# Altium project framework_can_interface.PrjPcb
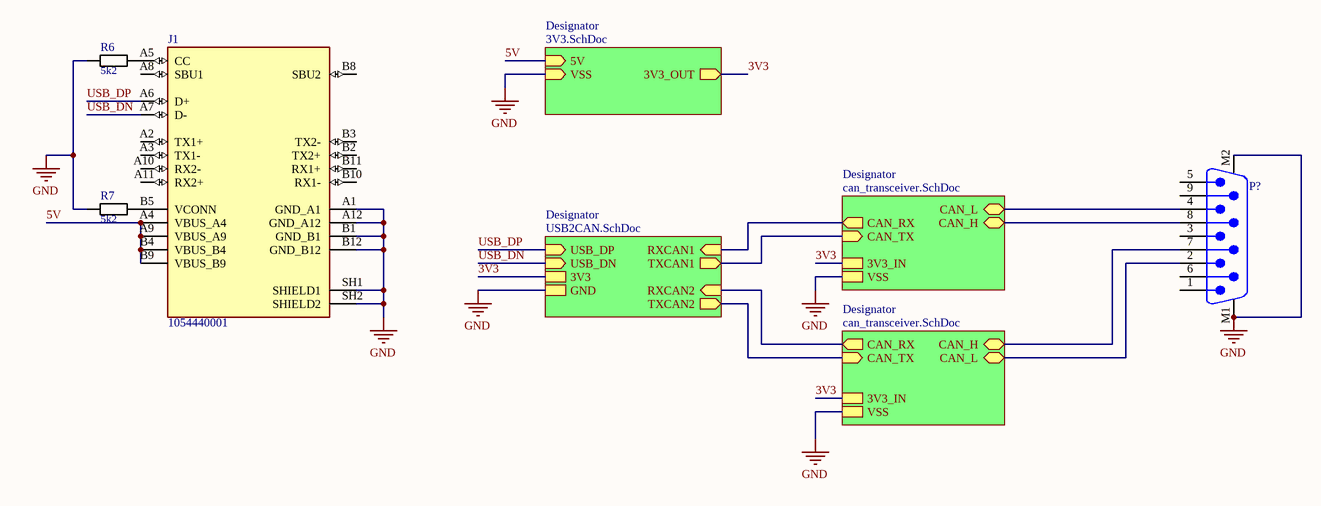
[diagram p0: main.SchDoc]
4 sheets, 52 parts. Net scope: hierarchical (ports join the sheet entries above them; power ports are global).
Board file: main.PcbDoc
Sheets:
  main.SchDoc
    Designator = 3V3.SchDoc
    Designator = USB2CAN.SchDoc
    Designator = can_transceiver.SchDoc
    Designator = can_transceiver.SchDoc

## Sheet main.SchDoc
size A4; SheetNumber: 1; SheetTotal: 4

### Parts
J1  1054440001  [MOLEX_1054440001]
P?  618009211721  [618009211721]  (value not drawn)
R6  5k2  [0603_R]
R7  5k2  [0603_R]

### Sub-sheets
Designator = 3V3.SchDoc: VSS (in), 5V (in), 3V3_OUT (out)
Designator = USB2CAN.SchDoc: USB_DP (in), USB_DN (in), 3V3, GND, RXCAN1 (in), TXCAN1 (out), RXCAN2 (in), TXCAN2 (out)
Designator = can_transceiver.SchDoc: CAN_H (bidir), CAN_L (bidir), CAN_TX (in), CAN_RX (out), 3V3_IN, VSS
Designator = can_transceiver.SchDoc: CAN_H (bidir), CAN_L (bidir), CAN_TX (in), CAN_RX (out), 3V3_IN, VSS

### Nets
3V3: sheet Designator/3V3_OUT, sheet Designator/3V3, sheet Designator/3V3_IN, sheet Designator/3V3_IN
GND: J1.A1(GND_A1) J1.A12(GND_A12) J1.B1(GND_B1) J1.B12(GND_B12) J1.SH1(SHIELD1) J1.SH2(SHIELD2) P?.M1 P?.M2 R6.1 R7.1 ; sheet Designator/VSS, sheet Designator/GND, sheet Designator/VSS, sheet Designator/VSS
5V: J1.A4(VBUS_A4) J1.A9(VBUS_A9) J1.B4(VBUS_B4) J1.B9(VBUS_B9) ; sheet Designator/5V
CAN High: P?.8 ; sheet Designator/CAN_H
CAN High: P?.7 ; sheet Designator/CAN_H  [a separate net that carries the same name]
CAN Low: P?.4 ; sheet Designator/CAN_L
CAN Low: P?.2 ; sheet Designator/CAN_L  [a separate net that carries the same name]
CAN_RX: sheet Designator/RXCAN2, sheet Designator/CAN_RX
CAN_RX: sheet Designator/RXCAN1, sheet Designator/CAN_RX  [a separate net that carries the same name]
CAN_TX: sheet Designator/TXCAN2, sheet Designator/CAN_TX
CAN_TX: sheet Designator/TXCAN1, sheet Designator/CAN_TX  [a separate net that carries the same name]
USB_DN: J1.A7(D-) ; sheet Designator/USB_DN
USB_DP: J1.A6(D+) ; sheet Designator/USB_DP
NetJ1_A5: J1.A5(CC) R6.2
NetJ1_B5: J1.B5(VCONN) R7.2

Not connected (* = marked no-connect by the designer): J1 A2(TX1+) A3(TX1-) A8(SBU1) A10(RX2-) A11(RX2+) B2(TX2+) B3(TX2-) B8(SBU2) B10(RX1-) B11(RX1+); P? 1 3 5 6 9

### Library data of the parts
J1 = 1054440001: USB-C (USB TYPE-C) USB 3.2 Gen 2 (USB 3.1 Gen 2, Superspeed + (USB 3.1)) Plug Connector 24 Position Board Edge, Straddle Mount; MF: Molex; SnapEDA_Link: https://www.snapeda.com/parts/1054440001/Molex/view-part/?ref=snap; Package: None; Value: *; MP: 1054440001; Check_prices: https://www.snapeda.com/parts/1054440001/Molex/view-part/?ref=eda
P? = 618009211721: WR-DSUB 8.08mm Male PCB Connector without Hex Screw, Angled, 9p; Manufacturer: Wurth Elektronik; Contact Resistance: 30mOhm; Rated Current: 3A; Working Voltage: 125VAC; Withstanding Voltage: 1000VAC; Manufacturer Part Number: 618009211721; Category: Input/Output Connectors; Match Code: WR-DSUB; ComponentLink1Description: Website Link; ComponentLink1URL: https://www.we-online.com/redexpert/article/618009211721?ad; ComponentLink2Description: Datasheet Link; ComponentLink2URL: https://www.we-online.com/redexpert/spec/618009211721?ad; Mount: Through Hole; Operating Temperature Max: 105°C; Operating Temperature Min: -55°C; Packaging: Tray; Gender: Male; Number of Pins: 9; Orientation: Angled
R6 R7 = R_0603: R 0603, 75V, 0.1W; EBS_Nummer: %%%; HelpURL: %%%; Value: 5k2

## Sheet 3V3.SchDoc
size A4; SheetNumber: 2; SheetTotal: 4
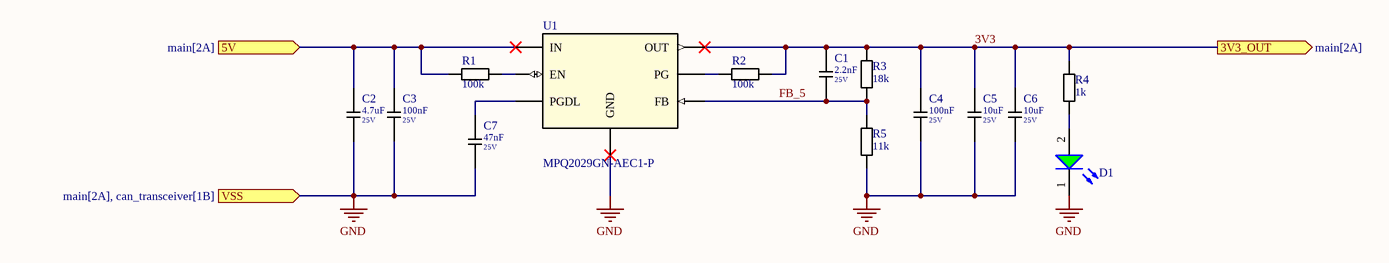
[diagram p1: 3V3.SchDoc]

### Parts
C1  value 2.2nF  Spg: 25V  [0603_C]  (hidden comment: 2.2nF_25V)
C2  value 4.7uF  Spg: 25V  [0603_C]  (hidden comment: 4.7uF_25V)
C3  value 100nF  Spg: 25V  [0603_C]  (hidden comment: 100nF_25V)
C4  value 100nF  Spg: 25V  [0603_C]  (hidden comment: 100nF_25V)
C5  value 10uF  Spg: 25V  [0603_C]  (hidden comment: 10uF_25V)
C6  value 10uF  Spg: 25V  [0603_C]  (hidden comment: 10uF_25V)
C7  value 47nF  Spg: 25V  [0603_C]  (hidden comment: 47nF_25V)
D1  Green, 3.2V, 140°  [WL-SMCD_0603]  (value not drawn)
R1  100k  [0603_R]
R2  100k  [0603_R]
R3  18k  [0603_R]
R4  1k  [0603_R]
R5  11k  [0603_R]
U1  MPQ2029GN-AEC1-P  [SOIC8-EP_MPQ2029_MNP]

### Ports
3V3_OUT (out, see main[2A]), 5V (in, see main[2A]), VSS (in, see main[2A], can_transceiver[1B])

### Nets
3V3: C1.1 C4.1 C5.1 C6.1 R2.2 R3.2 R4.2 U1.1(OUT) ; port 3V3_OUT
GND: C2.2 C3.2 C4.2 C5.2 C6.2 C7.2 D1.1(K) R5.1 U1.3(GND) ; port VSS
5V: C2.1 C3.1 R1.1 U1.4(IN) ; port 5V
FB_5: C1.2 R3.1 R5.2 U1.8(FB)
NetC7_1: C7.1 U1.7(PGDL)
NetD1_2: D1.2(A) R4.1
NetR1_2: R1.2 U1.5(EN)
NetR2_1: R2.1 U1.6(PG)

### Library data of the parts
C1-C7 = C_0603_Keramik: Keramikkondensatoren 0603; EBS_Nummer: %%%; HelpURL: %%%
D1 = 150060GS55040: WL-SMCD Mono-color Chip LED Diffused, SMT, size 0603, Green, 3.2V, 140°; Manufacturer: Wurth Elektronik; Case/Size Code: 0603; Chip Technology: InGaN; Dominant Wavelength: 525nm; Luminous Intensity: 430mcd; Peak Wavelength: 520nm; Manufacturer Part Number: 150060GS55040; Category: Signal LEDs; Match Code: WL-SMCD; ComponentLink1Description: Website Link; ComponentLink1URL: https://www.we-online.com/redexpert/article/150060GS55040?ad; ComponentLink2Description: Datasheet Link; ComponentLink2URL: https://www.we-online.com/redexpert/spec/150060GS55040?ad; Mount: Surface Mount; Operating Temperature Max: 85°C; Operating Temperature Min: -40°C; Packaging: Tape and Reel; Length: 1.6mm; Width: 0.8mm; Height: 0.4mm; Emitting Color: Green; Forward Voltage: 3.2V; Viewing Angle: 140°
R1-R5 = R_0603: R 0603, 75V, 0.1W; EBS_Nummer: %%%; HelpURL: %%%
  R1 R2: Value: 100k
  R3: Value: 18k
  R4: Value: 1k
  R5: Value: 11k
U1 = MPQ2029GN-AEC1-P: No Description Available; pin to pad: 3>3+9; Mfr_Name: Monolithic Power Systems; RefDes: RefDes; Type: Type

## Sheet USB2CAN.SchDoc
size A4; SheetNumber: 3; SheetTotal: 4; SPICEModelCacheDJWCCONK: <root> / <DocumentId>DJWCCONK</DocumentId> / <CacheFrame Number="0"> / <Model Name="0603_150060vs55040" Kind="CKT"> / <Text>***************************** / .subckt 0603_150060VS55040 1 2 / D1 1 2 SMCD / .MODEL SMCD D / + IS=135.21E-15 / + N=2.0992 / + RS=1.0413 / + IKF=173.47E-9 / + CJO=1.0000E-12 / + M=.3333 / + VJ=.75 / + BV=5 / + IBV=100.00E-6 / + TT=5.0000E-9 / .ends</Text> / </Model> / </CacheFrame> / </root>
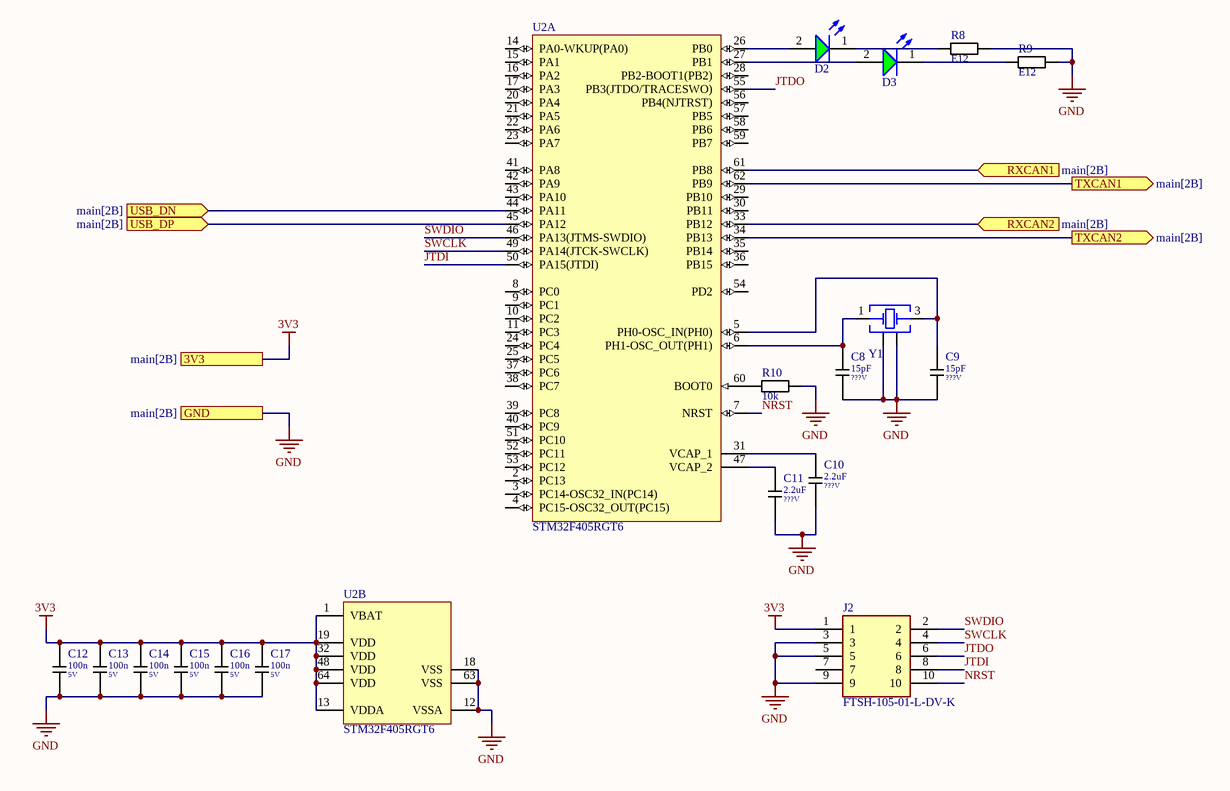
[diagram p2: USB2CAN.SchDoc]

### Parts
C8  value 15pF  Spg: ???V  [0603_C]  (hidden comment: 15pF_???V)
C9  value 15pF  Spg: ???V  [0603_C]  (hidden comment: 15pF_???V)
C10  value 2.2uF  Spg: ???V  [0603_C]  (hidden comment: 2.2uF_???V)
C11  value 2.2uF  Spg: ???V  [0603_C]  (hidden comment: 2.2uF_???V)
C12  value 100n  Spg: 5V  [0603_C]  (hidden comment: 100n_5V)
C13  value 100n  Spg: 5V  [0603_C]  (hidden comment: 100n_5V)
C14  value 100n  Spg: 5V  [0603_C]  (hidden comment: 100n_5V)
C15  value 100n  Spg: 5V  [0603_C]  (hidden comment: 100n_5V)
C16  value 100n  Spg: 5V  [0603_C]  (hidden comment: 100n_5V)
C17  value 100n  Spg: 5V  [0603_C]  (hidden comment: 100n_5V)
D2  Bright Green, 2V, 140°  [WL-SMCD_0603]  (value not drawn)
D3  Bright Green, 2V, 140°  [WL-SMCD_0603]  (value not drawn)
J2  FTSH-105-01-L-DV-K  [FTSH10501LDVK]
R8  E12  [0603_R]
R9  E12  [0603_R]
R10  10k  [0603_R]
U2  STM32F405RGT6  [STM-LQFP64_N]  (parts A,B of 2)
Y1  8MHz  [WE-XTAL_CFPX-180]  (value not drawn)

### Ports
3V3 (see main[2B]), GND (see main[2B]), RXCAN1 (in, see main[2B]), RXCAN2 (in, see main[2B]), TXCAN1 (out, see main[2B]), TXCAN2 (out, see main[2B]), USB_DN (in, see main[2B]), USB_DP (in, see main[2B])

### Nets
3V3: C12.1 C13.1 C14.1 C15.1 C16.1 C17.1 J2.1 U2.1(VBAT) U2.13(VDDA) U2.19(VDD) U2.32(VDD) U2.48(VDD) U2.64(VDD) ; port 3V3
GND: C8.2 C9.2 C10.2 C11.2 C12.2 C13.2 C14.2 C15.2 C16.2 C17.2 J2.3 J2.5 J2.9 R8.2 R9.2 R10.2 U2.12(VSSA) U2.18(VSS) U2.63(VSS) Y1.2(GND&Lid) Y1.4(GND&Lid) ; port GND
CAN_RX: U2.33(PB12) ; port RXCAN2
CAN_RX: U2.61(PB8) ; port RXCAN1  [a separate net that carries the same name]
CAN_TX: U2.34(PB13) ; port TXCAN2
CAN_TX: U2.62(PB9) ; port TXCAN1  [a separate net that carries the same name]
JTDI: J2.8 U2.50(PA15(JTDI))
JTDO: J2.6 U2.55(PB3(JTDO/TRACESWO))
NRST: J2.10 U2.7(NRST)
SWCLK: J2.4 U2.49(PA14(JTCK-SWCLK))
SWDIO: J2.2 U2.46(PA13(JTMS-SWDIO))
USB_DN: U2.44(PA11) ; port USB_DN
USB_DP: U2.45(PA12) ; port USB_DP
NetC8_1: C8.1 U2.6(PH1-OSC_OUT(PH1)) Y1.1(Crystal)
NetC9_1: C9.1 U2.5(PH0-OSC_IN(PH0)) Y1.3(Crystal)
NetC10_1: C10.1 U2.31(VCAP_1)
NetC11_1: C11.1 U2.47(VCAP_2)
NetD2_1: D2.1(K) R8.1
NetD2_2: D2.2(A) U2.26(PB0)
NetD3_1: D3.1(K) R9.1
NetD3_2: D3.2(A) U2.27(PB1)
NetR10_1: R10.1 U2.60(BOOT0)

Not connected (* = marked no-connect by the designer): J2 7; U2 2(PC13) 3(PC14-OSC32_IN(PC14)) 4(PC15-OSC32_OUT(PC15)) 8(PC0) 9(PC1) 10(PC2) 11(PC3) 14(PA0-WKUP(PA0)) 15(PA1) 16(PA2) 17(PA3) 20(PA4) 21(PA5) 22(PA6) 23(PA7) 24(PC4) 25(PC5) 28(PB2-BOOT1(PB2)) 29(PB10) 30(PB11) 35(PB14) 36(PB15) 37(PC6) 38(PC7) 39(PC8) 40(PC9) 41(PA8) 42(PA9) 43(PA10) 51(PC10) 52(PC11) 53(PC12) 54(PD2) 56(PB4(NJTRST)) 57(PB5) 58(PB6) 59(PB7)

### Library data of the parts
C8-C17 = C_0603_Keramik: as C1 on sheet 3V3; HelpURL: %%%
D2 D3 = 150060VS55040: WL-SMCD Mono-color Chip LED Diffused, SMT, size 0603, Bright Green, 2V, 140°; Manufacturer: Wurth Elektronik; Case/Size Code: 0603; Chip Technology: AlInGaP; Dominant Wavelength: 573nm; Luminous Intensity: 60mcd; Peak Wavelength: 575nm; Manufacturer Part Number: 150060VS55040; Category: Signal LEDs; Match Code: WL-SMCD; ComponentLink1Description: Website Link; ComponentLink1URL: https://www.we-online.com/redexpert/article/150060VS55040?ad; ComponentLink2Description: Datasheet Link; ComponentLink2URL: https://www.we-online.com/redexpert/spec/150060VS55040?ad; Mount: Surface Mount; Operating Temperature Max: 85°C; Operating Temperature Min: -40°C; Packaging: Tape and Reel; Length: 1.6mm; Width: 0.8mm; Height: 0.4mm; Emitting Color: Bright Green; Forward Voltage: 2V; Viewing Angle: 140°
J2 = FTSH-105-01-L-DV-K: Samtec, FTSH, 10 Way, 2 Row, Straight Pin Header; Geometry.Height: 6.1mm; Mouser Part Number: 200-FTSH10501LDVK; Mouser Price/Stock: https://www.mouser.co.uk/ProductDetail/Samtec/FTSH-105-01-L-DV-K?qs=%252B5JSS813miOqo3Vy%252BvhCFg%3D%3D; Manufacturer_Name: SAMTEC; Manufacturer_Part_Number: FTSH-105-01-L-DV-K; Datasheet Link: https://www.arrow.com/en/products/ftsh-105-01-l-dv-k/samtec
R8-R10 = R_0603: R 0603, 75V, 0.1W; EBS_Nummer: %%%; HelpURL: %%%
  R8 R9: Value: E12
  R10: Value: 10k
U2 = STM32F405RGT6: ARM Cortex-M4 32-bit MCU+FPU, 210 DMIPS, 1024 kB Flash, 192 kB Internal RAM, 51 I/Os, 64-pin LQFP, -40 to 85 degC, Tray; Manufacturer: STMicroelectronics; D/A Converter: 2x12-bit; FLASH Size (Prog) (kB): 1024; I/Os (High Current): 51; Internal RAM Size (kB): 192; Operating Frequency(F) (Processor speed) (MHz): 168; Supply Voltage(Vcc) max (V): 3.6; Supply Voltage(Vcc) min (V): 1.8; DatasheetVersion: Rev. 4; PackageVersion: Rev. 4, 06/2013; PackageReference: LQFP64; PackageDescription: 64-Pin Low Profile Quad Flat Package, 10 x 10 mm Body, 0.5 mm Pitch; Supplier 1: Digi-Key; Supplier Part Number 1: 497-11767-ND; Supplier 2: Farnell; Supplier Part Number 2: 2064363; Supplier 3: Newark; Supplier Part Number 3: 73T2329; Supplier 4: Mouser; Supplier Part Number 4: 511-STM32F405RGT6; Core: ARM Cortex-M4; Packing: Tray; Mounting Technology: Surface Mount; PartNumber: STM32F405RGT6; ComponentLink1Description: Manufacturer URL; ComponentLink1URL: http://www.st.com/web/en/home.html; ComponentLink2Description: Datasheet; ComponentLink2URL: http://www.st.com/st-web-ui/static/active/en/resource/technical/document/datasheet/DM00037051.pdf; ComponentLink3Description: Package Specification; ComponentLink3URL: http://www.st.com/st-web-ui/static/active/en/resource/technical/document/datasheet/DM00037051.pdf
Y1 = 830108313809: WE-XTAL Quartz Crystal, SMT, CFPX-180, 8MHz, +/-30ppm; Manufacturer: Wurth Elektronik; Frequency Stability: +/-50ppm; Load Capacitance: 12pF; ComponentLink1Description: Website Link; ComponentLink1URL: https://www.we-online.com/redexpert/article/830108313809?ad; ComponentLink2Description: Datasheet Link; ComponentLink2URL: https://www.we-online.com/redexpert/spec/830108313809?ad; Manufacturer Part Number: 830108313809; Category: Crystals; Match Code: WE-XTAL; Mount: Surface Mount; Operating Temperature Max: 85°C; Operating Temperature Min: -40°C; Packaging: Tape and Reel; Case/Size Code: CFPX-180; Length: 3.4mm; Width: 2.7mm; Height: 0.8mm; Frequency: 8MHz; Frequency Tolerance: +/-30ppm

## Sheet can_transceiver.SchDoc
size A4; SheetNumber: 4; SheetTotal: 4
Used 2 times, as channels Designator, Designator. Parts and nets are listed once, with the designators drawn on the sheet.
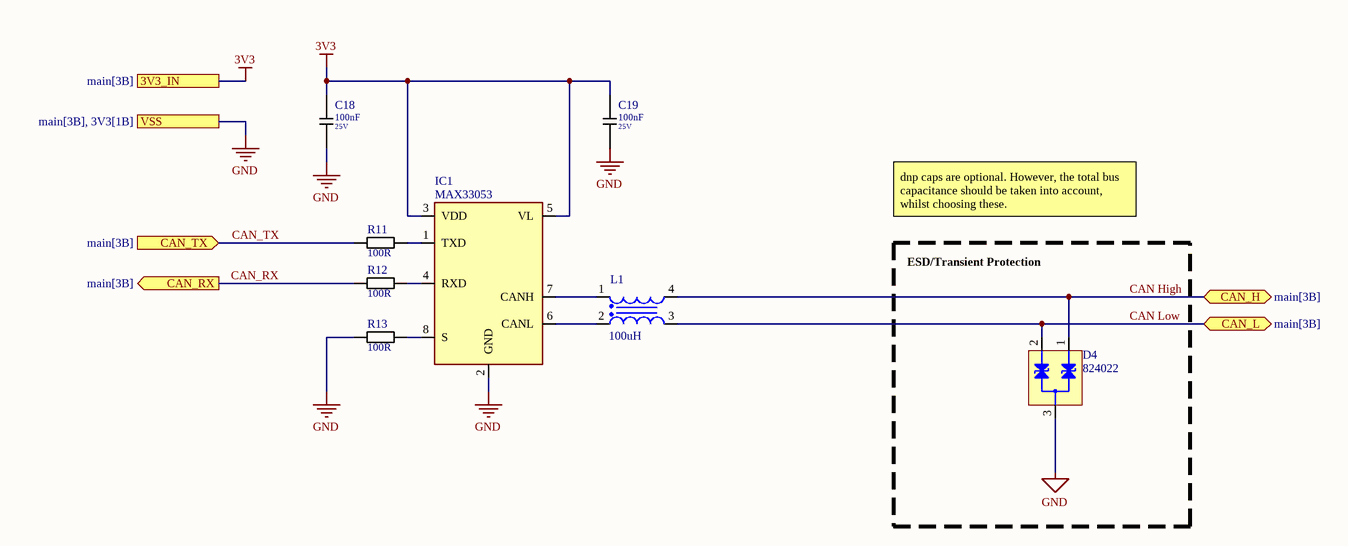
[diagram p3: can_transceiver.SchDoc]

### Parts
C18  value 100nF  Spg: 25V  [0603_C]  (hidden comment: 100nF_25V)
C19  value 100nF  Spg: 25V  [0603_C]  (hidden comment: 100nF_25V)
D4  5V  [WE-TVS_SOT23-3L]  (value not drawn)
IC1  MAX33053  [SOIC127P600X175-8N]
L1  100uH  [WE-SLM_L6W3.3H3.3]
R11  100R  [0603_R]
R12  100R  [0603_R]
R13  100R  [0603_R]

### Blocks framed on the sheet
ESD/Transient Protection: D4

### Ports
3V3_IN (see main[3B]), CAN_H (bidir, see main[3B]), CAN_L (bidir, see main[3B]), CAN_RX (out, see main[3B]), CAN_TX (in, see main[3B]), VSS (see main[3B], 3V3[1B])

### Nets
3V3: C18.1 C19.1 IC1.3(VDD) IC1.5(VL) ; port 3V3_IN
GND: C18.2 C19.2 D4.3(GND) IC1.2(GND) R13.1 ; port VSS
CAN High: D4.1(I/O_1) L1.4 ; port CAN_H
CAN Low: D4.2(I/O_2) L1.3 ; port CAN_L
CAN_RX: R12.1 ; port CAN_RX
CAN_TX: R11.1 ; port CAN_TX
NetIC1_1: IC1.1(TXD) R11.2
NetIC1_4: IC1.4(RXD) R12.2
NetIC1_6: IC1.6(CANL) L1.2
NetIC1_7: IC1.7(CANH) L1.1
NetIC1_8: IC1.8(S) R13.2

### Channels
Designator: designators end in _Designator#1; ports 3V3_IN=3V3 CAN_H=CAN High CAN_L=CAN Low CAN_RX=CAN_RX CAN_TX=CAN_TX VSS=GND
Designator: designators end in _Designator#2; ports 3V3_IN=3V3 CAN_H=CAN High CAN_L=CAN Low CAN_RX=CAN_RX CAN_TX=CAN_TX VSS=GND

### Notes on the sheet
- dnp caps are optional. However, the total bus capacitance should be taken into account, whilst choosing these.

### Library data of the parts
C18 C19 = C_0603_Keramik: as C1 on sheet 3V3; HelpURL: %%%
D4 = 824022: WE-TVS TVS Diode – Standard Series, SOT23-3L, 2 Channel, 5V, 12pF; Manufacturer: Wurth Elektronik; Channel ESD Clamping Voltage: 9V; Channel Reverse Leakage Current: 2.5uA; ESD Air Discharge Capability: 20kV; ESD Contact Discharge Capability: 12kV; Number of Channels: 2; Polarity: Bidirectional; (Reverse) Breakdown Voltage: 6.1V; (Reverse) Peak Pulse Current: 8A; Category: ESD Protection; Match Code: WE-TVS; ComponentLink1Description: Website Link; ComponentLink1URL: https://www.we-online.com/redexpert/article/824022?ad; ComponentLink2Description: Datasheet Link; ComponentLink2URL: https://www.we-online.com/redexpert/spec/824022?ad; Mount: Surface Mount; Operating Temperature Max: 125°C; Operating Temperature Min: -55°C; Packaging: Tape and Reel; Case/Size Code: SOT23-3L; Length: 2.9mm; Width: 2.4mm; Height: 1.1mm; Channel Input Capacitance: 12pF; Channel Operating Voltage: 5V; Manufacturer Part Number: 824022
IC1 = MAX33053: IC TRANSCEIVER FULL 1/1 8SOIC; Manufacturer_Name: Analog Devices; Manufacturer_Part_Number: MAX33053EASA+T; Geometry.Height: 1.75mm; Mouser Part Number: 700-MAX33053EASA+T; Mouser Price/Stock: https://www.mouser.co.uk/ProductDetail/Analog-Devices-Maxim-Integrated/MAX33054EASA%2bT?qs=byeeYqUIh0NWZc497A4ngw%3D%3D; Datasheet Link: https://componentsearchengine.com/Datasheets/1/MAX33054EASA+T.pdf
L1 = 744242101: WE-SLM SMT Common Mode Line Filter, 100uH, 0.3A, 0.58Ohm; Manufacturer: Wurth Elektronik; Impedance Max: 4000Ohm; Number of Windings: 2; Rated Voltage: 80V; Winding Style: bifiliar; ComponentLink1Description: Manufacturer Link; ComponentLink1URL: https://www.we-online.com/redexpert/article/744242101?ad; ComponentLink2Description: Datasheet; ComponentLink2URL: https://www.we-online.com/redexpert/spec/744242101?ad; Category: Common Mode Chokes; Match Code: WE-SLM; Manufacturer Part Number: 744242101; Mount: Surface Mount; Operating Temperature Max: 125°C; Operating Temperature Min: -40°C; Packaging: Tape and Reel; Length: 6mm; Width: 3.3mm; Height: 3.3mm; DC Resistance Max: 0.58Ohm; Inductance: 100uH; Rated Current: 0.3A
R11-R13 = R_0603: R 0603, 75V, 0.1W; EBS_Nummer: %%%; HelpURL: %%%; Value: 100R

## Nets that join several sheets
3V3: 3V3 (8 pins), USB2CAN (13 pins), Designator (C18_Designator#1.1 C19_Designator#1.1 IC1_Designator#1.3 IC1_Designator#1.5), Designator (C18_Designator#2.1 C19_Designator#2.1 IC1_Designator#2.3 IC1_Designator#2.5)
GND: main (10 pins), 3V3 (9 pins), USB2CAN (21 pins), Designator (5 pins), Designator (5 pins)
5V: main (J1.A4 J1.A9 J1.B4 J1.B9), 3V3 (C2.1 C3.1 R1.1 U1.4)
CAN High: main (P?.8), Designator (D4_Designator#1.1 L1_Designator#1.4)
CAN High: main (P?.7), Designator (D4_Designator#2.1 L1_Designator#2.4)
CAN Low: main (P?.4), Designator (D4_Designator#1.2 L1_Designator#1.3)
CAN Low: main (P?.2), Designator (D4_Designator#2.2 L1_Designator#2.3)
CAN_RX: USB2CAN (U2.33), Designator (R12_Designator#2.1)
CAN_RX: USB2CAN (U2.61), Designator (R12_Designator#1.1)
CAN_TX: USB2CAN (U2.34), Designator (R11_Designator#2.1)
CAN_TX: USB2CAN (U2.62), Designator (R11_Designator#1.1)
USB_DN: main (J1.A7), USB2CAN (U2.44)
USB_DP: main (J1.A6), USB2CAN (U2.45)